# EAGLE design Mega-NTP-GPS-Shieldv3 (EAGLE 7.1.0)
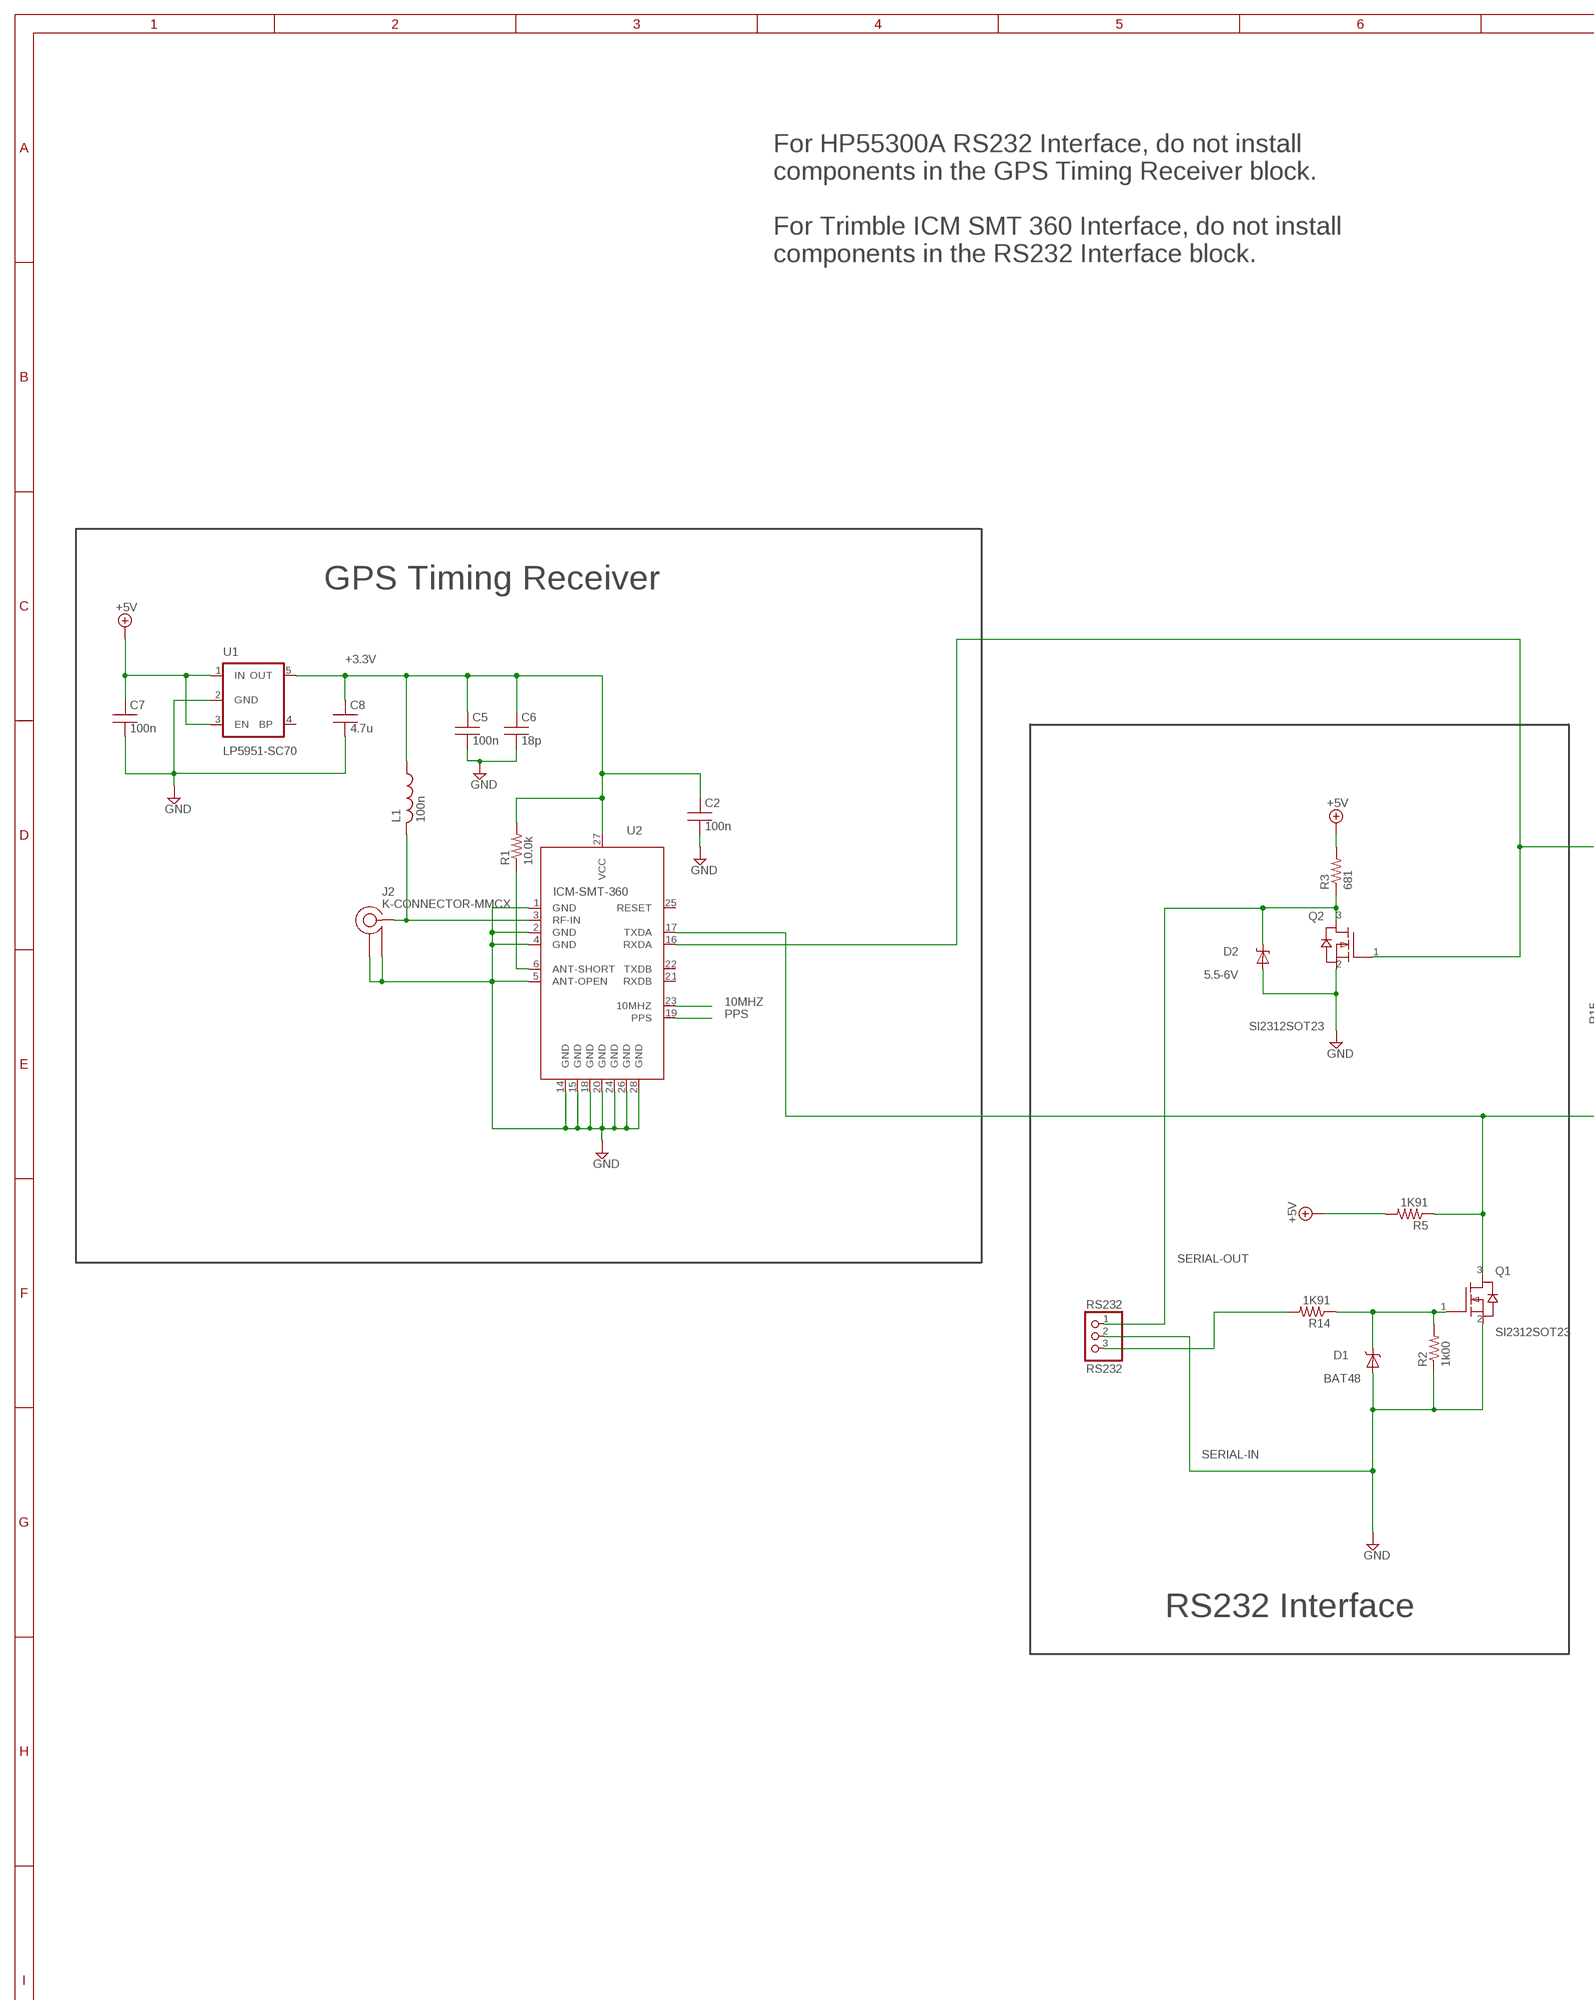
[diagram p0: schematic, sheet 1, part 1 of 2]
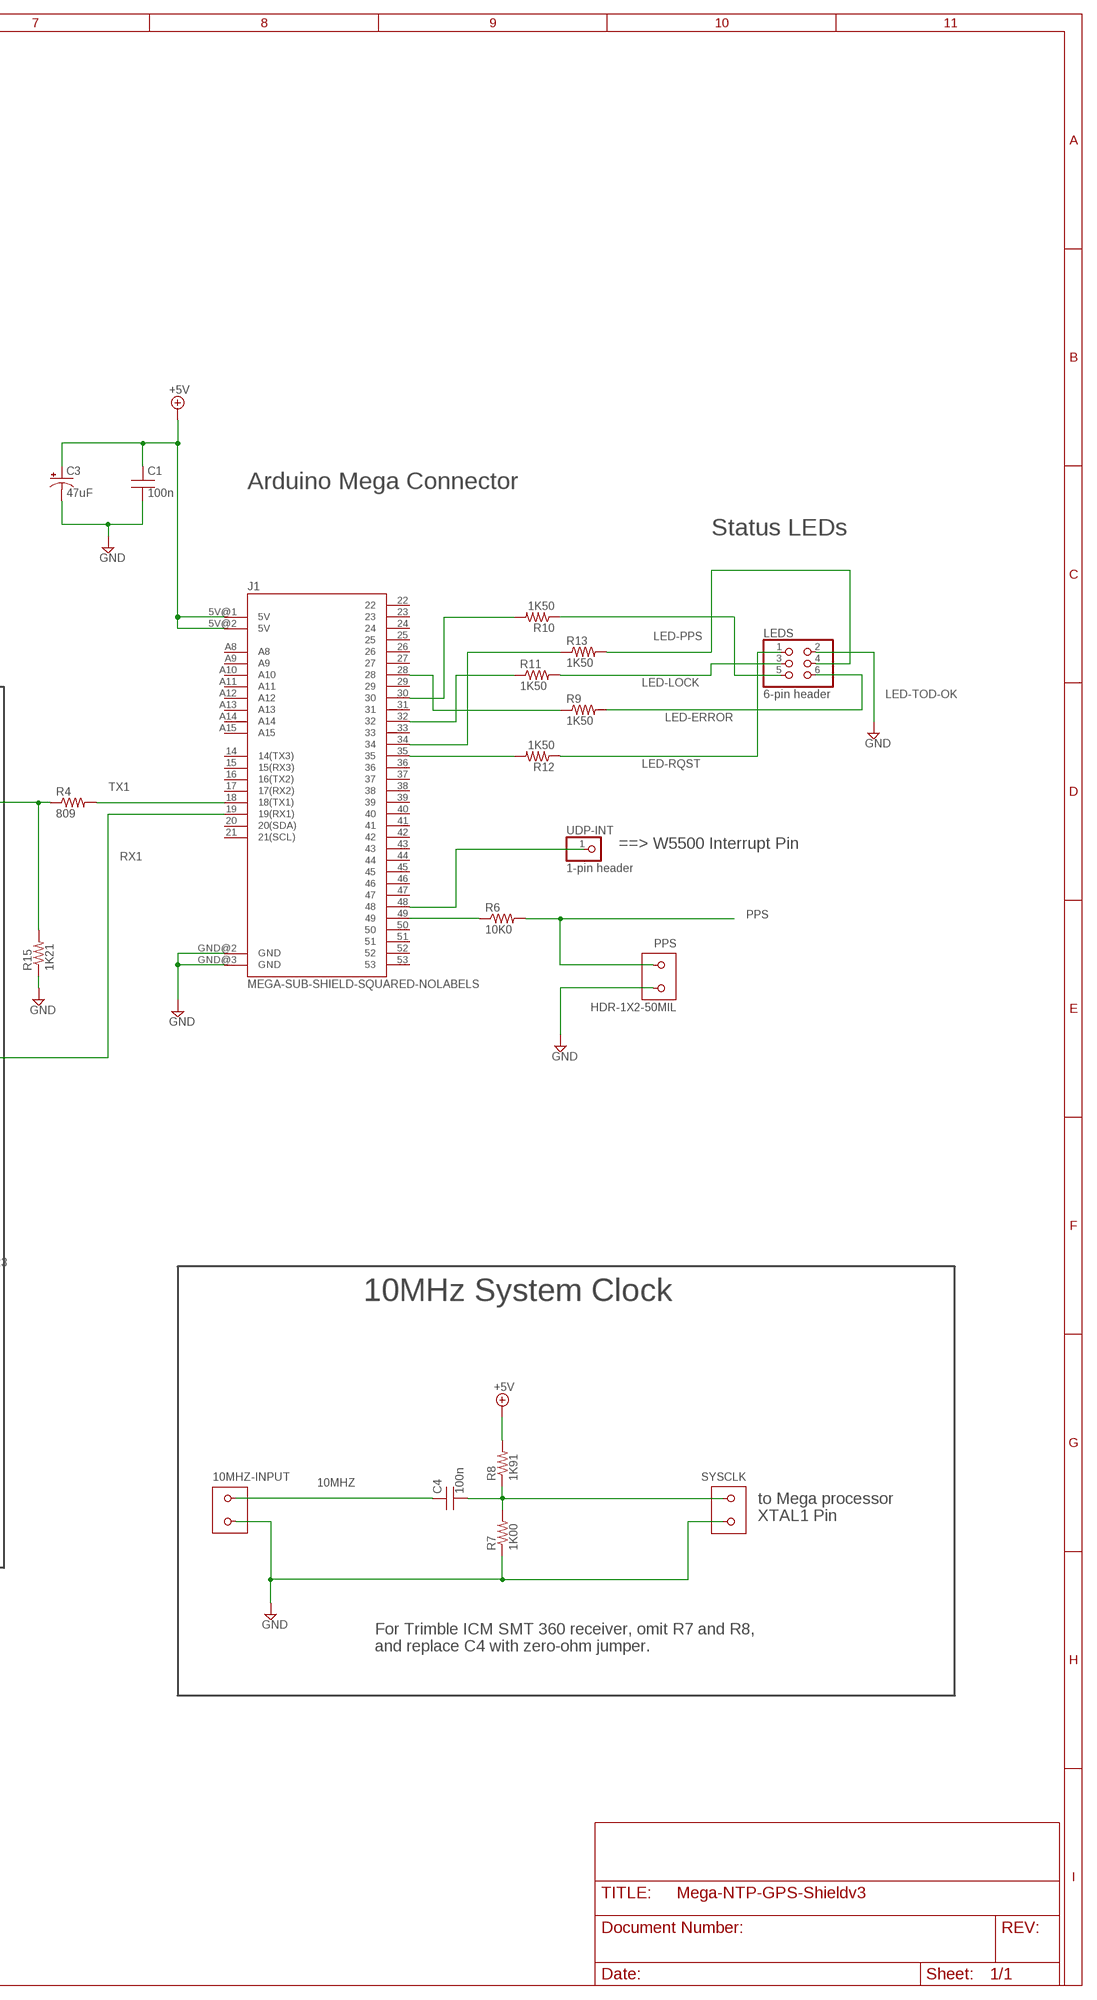
[diagram p1: schematic, sheet 1, part 2 of 2]

## Parts
10MHZ-INPUT  HDR-1X2-100MIL  [1X02-100MIL]
C1  100n  C-AVX-0805  [AVX-0805]
C2  100n  C-AVX-0805-NT  [AVX-0805-NT]
C3  47uF  47UF-TANT  [EIA3528]
C4  100n  C-AVX-0603  [AVX-0603]
C5  100n  C-AVX-0603-NT  [AVX-0603-NT]
C6  18p  C-AVX-0402-NT  [AVX-0402-NT]
C7  100n  C-AVX-0603-NT  [AVX-0603-NT]
C8  4.7u  C-AVX-0805-NT  [AVX-0805-NT]
D1  BAT48  DIODE-SCHOTTKY-SOD323  [SOD-323]
D2  5.5-6V  DIODE-ZENER-BZT52  [SOD-323]
J1  MEGA-SUB-SHIELD-SQUARED-NOLABELS  [MEGA-SUB-SHIELD-SQUARED-NOLABELS]
J2  K-CONNECTOR-MMCX  [MOLEX-MMCX-VERTICAL]
L1  100n  MURATA-LQW04A-LQW181-NT  [AVX-0603-NT]
LEDS  6-pin header  HDR-2X3-ROW-SWAP-50MIL  [2X03-50MIL]
PPS  HDR-1X2-50MIL  [1X02-50MIL]
Q1  SI2312SOT23  [SOT23]
Q2  SI2312SOT23  [SOT23]
R1  10.0k  R-AVX-0603  [AVX-0603]
R2  1k00  R-AVX-0603-NT  [AVX-0603-NT]
R3  681  R-AVX-0603  [AVX-0603]
R4  809  R-AVX-0603  [AVX-0603]
R5  1K91  R-AVX-0603  [AVX-0603]
R6  10K0  R-AVX-0603  [AVX-0603]
R7  1K00  R-AVX-0603  [AVX-0603]
R8  1K91  R-AVX-0603  [AVX-0603]
R9  1K50  R-AVX-0603  [AVX-0603]
R10  1K50  R-AVX-0603  [AVX-0603]
R11  1K50  R-AVX-0603  [AVX-0603]
R12  1K50  R-AVX-0603  [AVX-0603]
R13  1K50  R-AVX-0603  [AVX-0603]
R14  1K91  R-AVX-0603  [AVX-0603]
R15  1K21  R-AVX-0603-NT  [AVX-0603-NT]
RS232  RS232  HDR-1X3-ALL-SWAP-100-MIL  [1X03-100MIL]
SYSCLK  HDR-1X2-100MIL  [1X02-100MIL]
U1  LP5951-SC70  V_REG_LDOSMD2  [SC70]
U2  ICM-SMT-360  TRIMBLE-ICM-SMT-360-GPS-TIMING-MODULE  [TRIMBLE-ICM-SMT-360]
UDP-INT  1-pin header  PINHD-1X1  [1X01]

## Nets
10MHZ: 10MHZ-INPUT.1 C4.1 U2.23(10MHZ)
+3.3V: C2.1 C5.1 C6.1 C8.1 L1.1 R1.2 U1.5(OUT) U2.27(VCC)
+5V: C1.1 C3.A(+) C7.1 J1.5V@1(5V) J1.5V@2(5V) R3.2 R5.2 R8.2 U1.1(IN) U1.3(EN)
ANTENNA: J2.CENTER L1.2 U2.3(RF-IN)
GND: 10MHZ-INPUT.2 C1.2 C2.2 C3.C(-) C5.2 C6.2 C7.2 C8.2 D1.2(A) D2.2(A) J1.GND@2(GND) J1.GND@3(GND) J2.GND1 J2.GND2 LEDS.2 PPS.2 Q1.2(S) Q2.2(S) R2.1 R7.1 R15.1 RS232.2 SYSCLK.2 U1.2(GND) U2.1(GND) U2.2(GND) U2.4(GND) U2.5(ANT-OPEN) U2.14(GND) U2.15(GND) U2.18(GND) U2.20(GND) U2.24(GND) U2.26(GND) U2.28(GND)
LED-ERROR: LEDS.6 R9.2
LED-LOCK: LEDS.3 R11.2
LED-PPS: LEDS.4 R13.2
LED-RQST: LEDS.1 R12.1
LED-TOD-OK: LEDS.5 R10.1
N$1: Q2.1(G) R4.1 R15.2 U2.16(RXDA)
N$3: C4.2 R7.2 R8.1 SYSCLK.1
N$4: R1.1 U2.6(ANT-SHORT)
N$7: J1.49 R6.1
N$10: D1.1(C) Q1.1(G) R2.2 R14.1
N$11: J1.48 UDP-INT.1
N$17: J1.34 R13.1
N$18: J1.35 R12.2
N$19: J1.32 R11.1
N$20: J1.30 R10.2
N$21: J1.28 R9.1
PPS: PPS.1 R6.2 U2.19(PPS)
RX1: J1.19(19(RX1)) Q1.3(D) R5.1 U2.17(TXDA)
SERIAL-IN: R14.2 RS232.3
SERIAL-OUT: D2.1(C) Q2.3(D) R3.1 RS232.1
TX1: J1.18(18(TX1)) R4.2
Unconnected: J1.14(14(TX3)) J1.15(15(RX3)) J1.16(16(TX2)) J1.17(17(RX2)) J1.20(20(SDA)) J1.21(21(SCL)) J1.22 J1.23 J1.24 J1.25 J1.26 J1.27 J1.29 J1.31 J1.33 J1.36 J1.37 J1.38 J1.39 J1.40 J1.41 J1.42 J1.43 J1.44 J1.45 J1.46 J1.47 J1.50 J1.51 J1.52 J1.53 J1.A8 J1.A9 J1.A10 J1.A11 J1.A12 J1.A13 J1.A14 J1.A15 U1.4(BP) U2.21(RXDB) U2.22(TXDB) U2.25(RESET)

## Notes on the sheet
- For HP55300A RS232 Interface, do not install
  components in the GPS Timing Receiver block.
  
  For Trimble ICM SMT 360 Interface, do not install 
  components in the RS232 Interface block.
- Arduino Mega Connector
- Status LEDs
- GPS Timing Receiver
- ==> W5500 Interrupt Pin
- 10MHz System Clock
- to Mega processor
  XTAL1 Pin
- RS232 Interface
- For Trimble ICM SMT 360 receiver, omit R7 and R8,
  and replace C4 with zero-ohm jumper.

## Library data of the parts
10MHZ-INPUT PPS SYSCLK = max-local:HDR-1X2: Discrete wire thru-hole pattern (2-wires) 45-mil holes for 18-gauge wire on 150-mil centers
C1 C2 = max-local:C-AVX-0805: AVX 0805 SMT Capacitor Footprint as recommended by AVX in their SMT capacitor catalog. Should also work for Panasonic PPS film capacitors in size codes J1, J2.; MFR: AVX; MPN: 0805(3/5)C104(J/K)ATxx
C3 = SparkFun-Capacitors:47UF-TANT: 47uF Tantalum SMT CAP-08310- 10V 10% (EIA-3528); MFR: Vishay/Sprague; MPN: TR3B476K010C0350; PROD_ID: CAP-08310
C4 C5 C7 = max-local:C-AVX-0603: AVX 0603 SMT Capacitor Footprint as recommended by AVX in their SMT capacitor catalog. Should also work for Panasonic PPS film capacitors in size code K1.; MFR: AVX; MPN: 0603(3/5)C104(J/K)ATxx
C6 = max-local:C-AVX-0402; MFR: AVX; MPN: 04025A180JATxx
C8 = max-local:C-AVX-0805: AVX 0805 SMT Capacitor Footprint as recommended by AVX in their SMT capacitor catalog. Should also work for Panasonic PPS film capacitors in size codes J1, J2.; MFR: AVX; MPN: C0805YC475KATxx
D1 = SparkFun-DiscreteSemi:DIODE-SCHOTTKY: Commonly MBRA140.
D2 = SparkFun-DiscreteSemi:DIODE-ZENER: Zener Diode Production Part - 8199 3.4V Zener Voltage
J1 = SparkFun-Boards:MEGA-SUB-SHIELD: Shield for Mega that only uses lower pins Will not interfere with shields like the Ethernet which need to plug into the ICSP pins.
J2 = max-local:K-CONNECTOR: K-Connector; DIGIKEY: WM3914CT-ND; MFR: Molex; MPN: 73415-206x
L1 = max-local:MURATA-LQW04A: Murata high-frequency wirewound SMT inductors LQW04A is the 0315 package, and LQW15A is the 0402 size; MFR: Murata; MPN: LQW18ANR10J00
LEDS = max-local:HDR-2X3-ROW-SWAP
Q1 Q2 = max-local:SI2312: Siliconix Si2313 N-channel MOSFET 20V, 6A, 0.026 ohm (4.5V Vgs); MFR: Siliconix; MPN: SI2312BDS
R1 = max-local:R-AVX-0603: SMT 0603 Resistor Footprint from AVX SMT capacitor catalog.; MFR: Vishay/Dale; MPN: CRCW060310.0kFKxx
R2 R14 R15 = max-local:R-AVX-0603: SMT 0603 Resistor Footprint from AVX SMT capacitor catalog.; MFR: Vishay/Dale; MPN: CRCW06034K02FKxx
R3 = max-local:R-AVX-0603: SMT 0603 Resistor Footprint from AVX SMT capacitor catalog.; MFR: Vishay/Dale; MPN: CRCW0603DNP (681)FKxx
R4 R5 R7 R8 = max-local:R-AVX-0603: SMT 0603 Resistor Footprint from AVX SMT capacitor catalog.; MFR: Vishay/Dale; MPN: CRCW06031K91FKxx
R6 = max-local:R-AVX-0603: SMT 0603 Resistor Footprint from AVX SMT capacitor catalog.; MFR: Vishay/Dale; MPN: CRCW060310K0FKxx
R9-R13 = max-local:R-AVX-0603: SMT 0603 Resistor Footprint from AVX SMT capacitor catalog.; MFR: Vishay/Dale; MPN: CRCW06031K50FKxx
RS232 = max-local:HDR-1X3-ALL-SWAP
U1 = SparkFun-PowerIC:V_REG_LDO: Voltage Regulator LDO Standard 150mA LDO voltage regulator in SOT-23 layout. Micrel part MIC5205. BP (by-pass) pin is used to lower output noise with 470pF cap.; MFR: TI; MPN: LP5951MG-3.3/NOPB
U2 = max-local:TRIMBLE-ICM-SMT-360-GPS-TIMING-MODULE: Trimble GPS Timing Module ICM 360 SMT; MFR: Trimble; MPN: ICM-SMT-360
UDP-INT = pinhead:PINHD-1X1: PIN HEADER

## Board
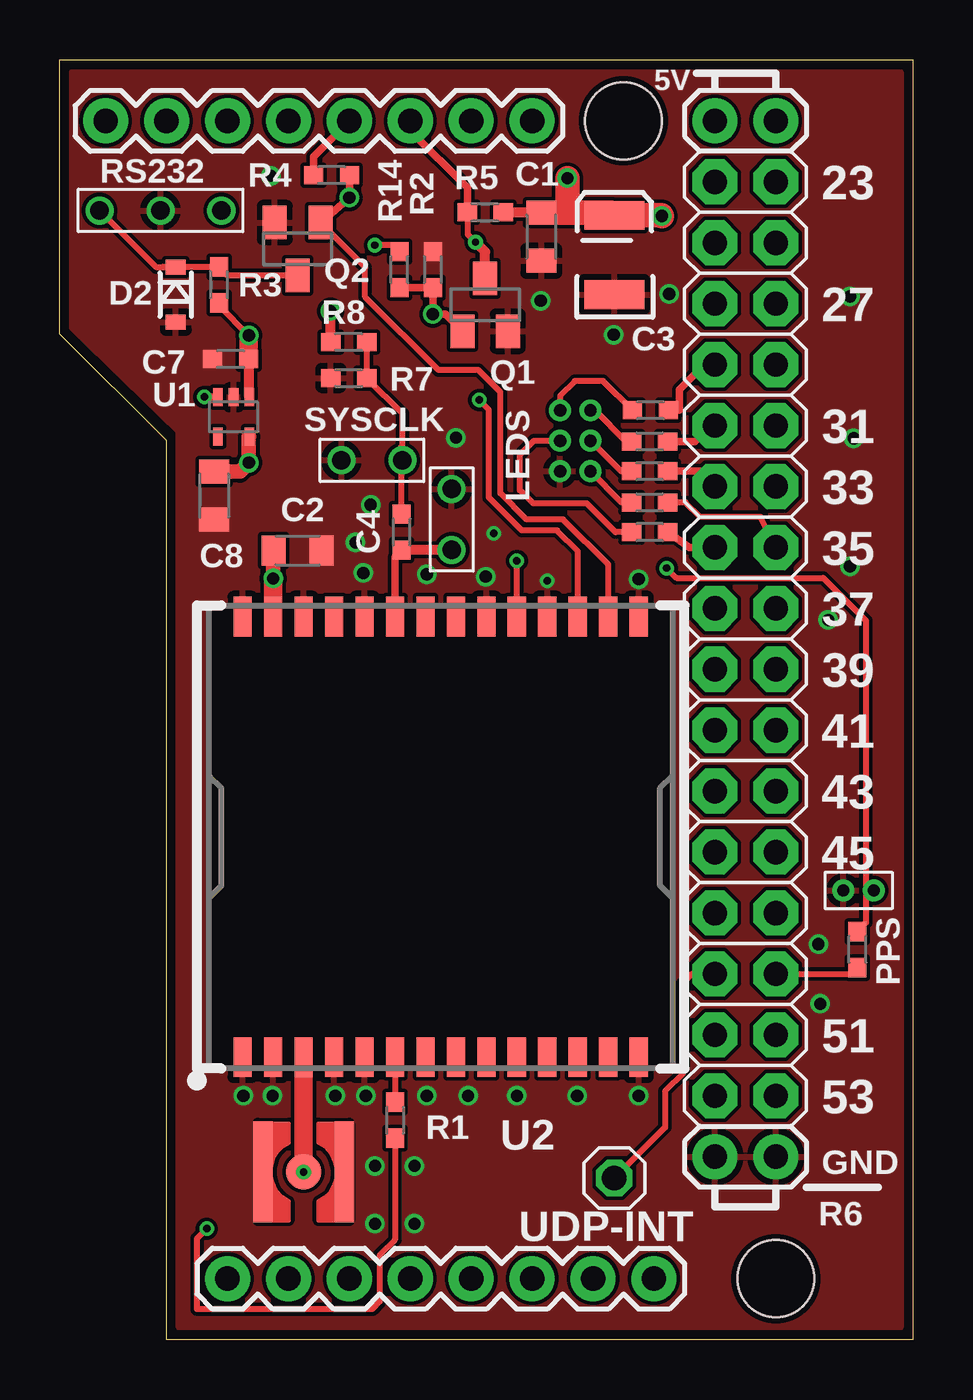
[diagram p2: board, top side]
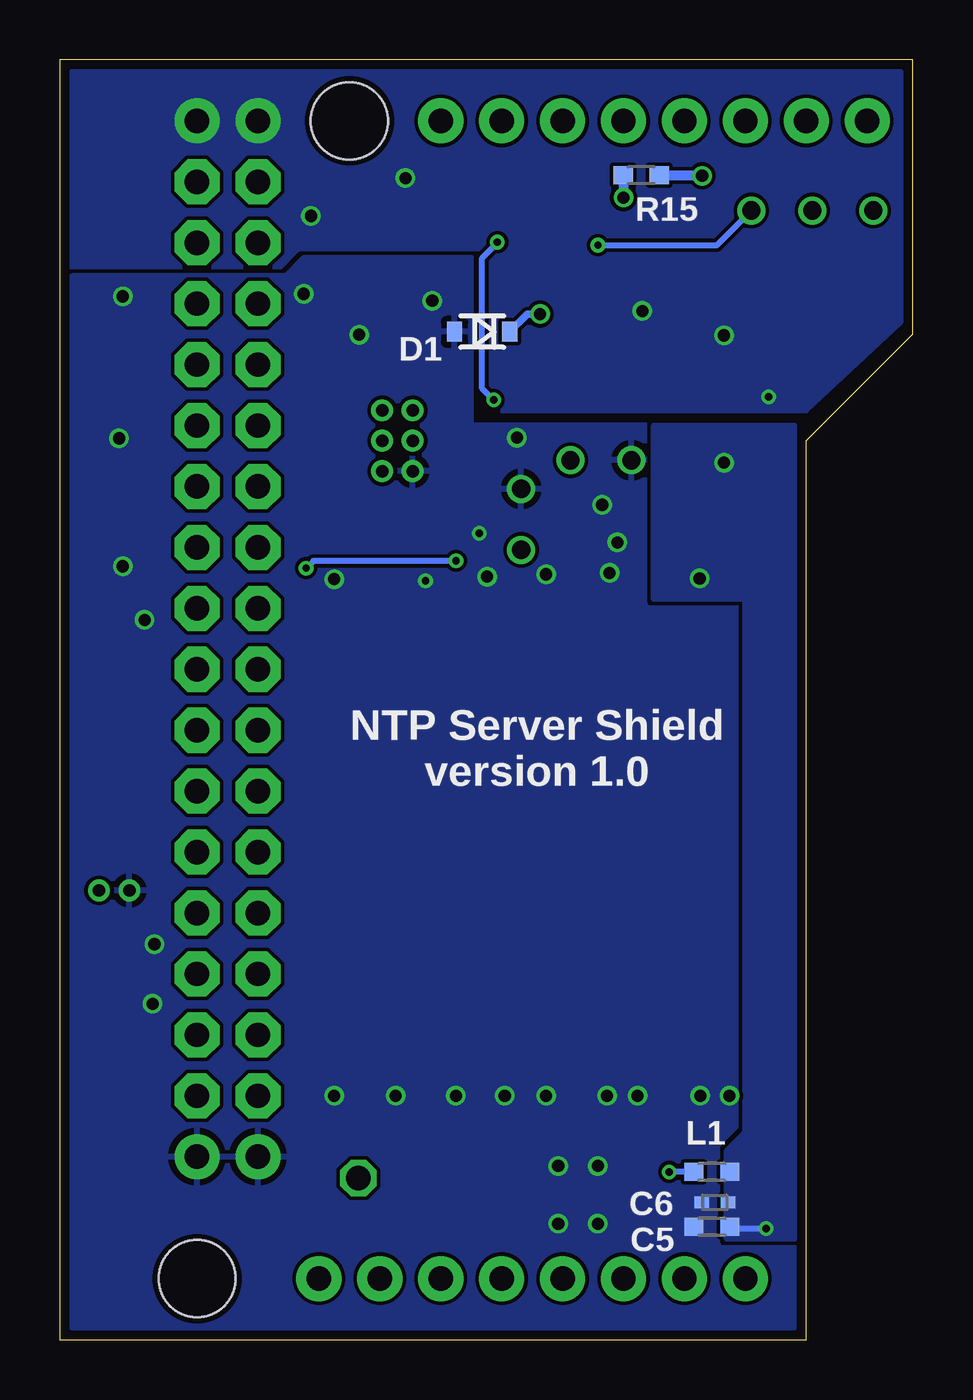
[diagram p3: board, bottom side, seen from below]

Size 35.56 x 53.34 mm. Coordinates in mm from the lower left corner, seen from the top.
Copper layers (1*16): Top 0.035mm / dielectric 1.5mm / Bottom 0.035mm
Design rules "SeeedStudio_2layer_DRU_no_angle_20140221 *": minimum track width 6mil, minimum drill 12mil, track to track 6mil, track to pad 6mil, pad to pad 6mil, via to via 6mil, smd to smd 0mil, copper to edge 10mil, drill to drill 10mil, minimum pad ring 8mil, minimum via ring 6mil, stop-mask expansion 2mil, vias tented up to drill 100mil, thermal gap 10mil

### Footprints (pad centres in the part's own frame; a part is rotated, then mirrored left to right if it is on the bottom)
1X02-100MIL = drill 0.762: 1 -1.27,0; 2 1.27,0
AVX-0805 = smd 1 x 1.25: 1 -1,0; 2 1,0
AVX-0805-NT = smd 1 x 1.25: 1 -1,0; 2 1,0
EIA3528 = smd 1.2 x 2.5: A 1.65,0; C -1.65,0
AVX-0603 = smd 0.8 x 0.75: 1 -0.75,0; 2 0.75,0
AVX-0603-NT = smd 0.8 x 0.75: 1 -0.75,0; 2 0.75,0
AVX-0402-NT = smd 0.6 x 0.5: 1 -0.55,0; 2 0.55,0
SOD-323 = smd 0.63 x 0.83: 1 -1.15,0; 2 1.15,0
MEGA-SUB-SHIELD-SQUARED-NOLABELS = drill 1.016 pad 1.88: 5V@1 27.305,50.8; 5V@2 29.845,50.8; 14 1.905,50.8; 15 4.445,50.8; 16 6.985,50.8; 17 9.525,50.8; 18 12.065,50.8; 19 14.605,50.8; 20 17.145,50.8; 21 19.685,50.8; A8 6.985,2.54; A9 9.525,2.54; A10 12.065,2.54; A11 14.605,2.54; A12 17.145,2.54; A13 19.685,2.54; A14 22.225,2.54; A15 24.765,2.54; GND@2 27.305,7.62; GND@3 29.845,7.62 | drill 1.016 pad 1.88 octagon: 22 27.305,48.26; 23 29.845,48.26; 24 27.305,45.72; 25 29.845,45.72; 26 27.305,43.18; 27 29.845,43.18; 28 27.305,40.64; 29 29.845,40.64; 30 27.305,38.1; 31 29.845,38.1; 32 27.305,35.56; 33 29.845,35.56; 34 27.305,33.02; 35 29.845,33.02; 36 27.305,30.48; 37 29.845,30.48; 38 27.305,27.94; 39 29.845,27.94; 40 27.305,25.4; 41 29.845,25.4; 42 27.305,22.86; 43 29.845,22.86; 44 27.305,20.32; 45 29.845,20.32; 46 27.305,17.78; 47 29.845,17.78; 48 27.305,15.24; 49 29.845,15.24; 50 27.305,12.7; 51 29.845,12.7; 52 27.305,10.16; 53 29.845,10.16 | hole 3.2: 23.495,50.8; 29.845,2.54
MOLEX-MMCX-VERTICAL = smd 1.473 x 1.473: CENTER 0,0 | smd 0.813 x 4.216: GND1 -1.702,0; GND2 1.702,0
2X03-50MIL = drill 0.508 pad 0.914: 1 -1.27,-0.635; 2 -1.27,0.635; 3 0,-0.635; 4 0,0.635; 5 1.27,-0.635; 6 1.27,0.635
1X02-50MIL = drill 0.508: 1 -0.635,0; 2 0.635,0
SOT23 = smd 1 x 1.4: 1 -0.95,-1.1; 2 0.95,-1.1; 3 0,1.1
1X03-100MIL = drill 0.762: 1 -2.54,0; 2 0,0; 3 2.54,0
SC70 = smd 0.4 x 0.75: 1 -0.65,-0.825; 2 0,-0.825; 3 0.65,-0.825; 4 0.65,0.825; 5 -0.65,0.825
TRIMBLE-ICM-SMT-360 = smd 1.651 x 0.762: 1 -9.182,8.255; 2 -9.182,6.985; 3 -9.182,5.715; 4 -9.182,4.445; 5 -9.182,3.175; 6 -9.182,1.905; 7 -9.182,0.635; 8 -9.182,-0.635; 9 -9.182,-1.905; 10 -9.182,-3.175; 11 -9.182,-4.445; 12 -9.182,-5.715; 13 -9.182,-6.985; 14 -9.182,-8.255; 15 9.182,-8.255; 16 9.182,-6.985; 17 9.182,-5.715; 18 9.182,-4.445; 19 9.182,-3.175; 20 9.182,-1.905; 21 9.182,-0.635; 22 9.182,0.635; 23 9.182,1.905; 24 9.182,3.175; 25 9.182,4.445; 26 9.182,5.715; 27 9.182,6.985; 28 9.182,8.255
1X01 = drill 1.016 octagon: 1 0,0

### Placement (x,y rotation side)
10MHZ-INPUT  16.33,34.19 90 top
C1  20.07,45.97 270 top
C2  9.91,32.89 0 top
C3  23.11,45.21 90 top
C4  14.25,33.66 90 top
C5  8.38,4.7 180 bottom
C6  8.26,5.71 180 bottom
C7  7.11,40.87 180 top
C8  6.43,35.18 270 top
D1  17.96,42.01 180 bottom
D2  4.83,43.56 270 top
J1  0,0 0 top
J2  10.16,6.99 0 top
L1  8.38,6.99 180 bottom
LEDS  21.49,37.47 90 top
PPS  33.3,18.72 180 top
Q1  17.73,43.13 0 top
Q2  9.91,45.47 180 top
R1  13.97,9.14 270 top
R2  15.54,44.6 270 top
R3  6.63,43.97 270 top
R4  11.33,48.54 180 top
R5  17.73,46.99 0 top
R6  33.25,16.26 90 top
R7  12.04,40.08 0 top
R8  12.04,41.58 180 top
R9  24.61,38.73 180 top
R10  24.59,37.44 0 top
R11  24.59,36.2 180 top
R12  24.59,34.9 0 top
R13  24.59,33.66 180 top
R14  14.15,44.6 90 top
R15  11.33,48.54 180 bottom
RS232  4.19,47.07 0 top
SYSCLK  13,36.65 180 top
U1  7.24,38.46 180 top
U2  15.88,20.95 90 top
UDP-INT  23.11,6.73 0 top

### Tracks (layer width: path | path; a pad name or v marks a point on that pad's centre or on a via)
10MHZ
  Top 0.305: U2.23 13.97,32.63 C4.1
  Top 0.406: 10MHZ-INPUT.1 C4.1
+3.3V  (via drill 0.3, 0.51)
  Top 0.254: R1.2 13.97,4.17 13.34,3.53 13.34,1.57 13.03,1.27 5.71,1.27 5.71,4.22 v6.12,4.62
  Top 0.61: U1.5 7.87,37.63 v7.87,36.55 7.5,36.18 C8.1 | v8.89,31.73 8.89,33.16 C2.1
  Top 0.762: U2.27 v8.89,31.73
  Bottom 0.254: v6.12,4.62 7.56,4.62 C5.1
  pour Bottom: 4.95,38.1 4.95,30.86 10.79,30.86 10.79,38.1
  pour Bottom: 4.95,30.99 4.95,4.19 7.75,4.19 7.75,7.87 6.99,8.64 6.99,30.99
+5V  (via drill 0.3, 0.51)
  Top 0.254: v7.87,41.86 6.63,43.1 R3.2
  Top 0.305: U1.3 5.91,39.28 v6.02,39.29
  Top 0.406: R5.2 20.05,46.99 C1.1 | U1.1 7.89,40.84 C7.1 | R8.2 11.29,42.86 v11.28,42.88
  Top 0.762: C7.1 7.86,41.85 v7.87,41.86
  Top 1.016: v25.09,46.84 25.07,46.86 C3.A 23,46.97 C1.1 | v21.16,48.41 21.16,46.99
  pour Bottom (rank 2, no thermals): 4.45,38.73 0.51,42.42 0.51,52.83 35.05,52.83 35.05,38.73
ANTENNA  (via drill 0.3)
  Top 0.762: U2.3 J2.CENTER
  Bottom 0.254: L1.2 J2.CENTER
  other vias: 10.16,6.99
GND  (via drill 0.3, 0.51)
  Bottom 0.406: R15.1 8.79,48.54 v8.79,48.51
  other vias: 12.32,33.22 17.75,31.8 18.08,33.6 20.32,31.62 24.13,10.16 31.62,16.48 31.7,14 32.03,30 32.94,32.23 17.02,10.16 15.29,10.16 19.05,10.16 21.56,10.16 11.48,10.16 8.86,10.16 7.65,10.16 33.1,37.57 15.29,31.9 16.51,37.59 12.95,34.8 32.94,43.48 25.4,43.59 20.04,43.31 12.65,31.95 13.13,7.24 13.13,4.83 14.78,4.83 14.78,7.24 12.75,10.16 23.09,41.88 24.13,31.7
  pour Top: 4.95,0.51 4.95,37.85 0.51,42.16 0.51,52.83 35.05,52.83 35.05,0.51
  pour Bottom (rank 2): 4.95,38.1 35.05,38.1 35.05,0.51 4.95,0.51
  pour Bottom: 18.41,36.2 18.41,45.09 25.4,45.09 26.14,44.32 35.05,44.32 35.05,36.2
LED-ERROR
  Top 0.254: R9.2 22.64,39.95 21.46,39.95 20.85,39.34 LEDS.6
LED-LOCK
  Top 0.254: R11.2 23.39,36.2 LEDS.3
LED-PPS
  Top 0.254: R13.2 23.16,33.66 21.97,34.85 19.74,34.85 19.18,35.41 19.18,36.88 19.76,37.47 LEDS.4
LED-RQST
  Top 0.254: R12.1 23.42,34.9 LEDS.1
LED-TOD-OK
  Top 0.254: R10.1 23.6,37.44 22.3,38.73
  Top 0.305: 22.3,38.73 LEDS.5
N$1  (via drill 0.51)
  Top 0.254: U2.16 22.86,32.31 20.98,34.19 19.46,34.19 18.36,35.28 18.36,39.5 17.45,40.41 15.77,40.41 12.72,43.46 12.72,44.7 Q2.1
  Top 0.305: R15.2 12.06,48.54 v12.06,47.6 Q2.1
  Bottom 0.406: R15.2 12.06,48.54 v12.06,47.6
N$3
  Top 0.254: R8.1 R7.2 14.28,38.6 SYSCLK.1 14.25,37.26 C4.2
N$4
  Top 0.254: U2.6 R1.1
N$7
  Top 0.254: J1.49 33.03,15.24 R6.1
N$10  (via drill 0.51)
  Top 0.305: R14.1 R2.2 v15.54,42.75 16.07,42.75 Q1.1
  Bottom 0.305: v15.54,42.75 16.07,42.75 D1.1
N$11
  Top 0.254: J1.48 26.34,15.24 25.98,14.88 25.98,11.12 25.22,10.36 25.22,8.84 UDP-INT.1
N$17
  Top 0.305: J1.34 26.25,33.02 R13.1
N$18
  Top 0.254: J1.35 29.21,34.29 26.7,34.29 26.09,34.9 R12.2
N$19
  Top 0.305: J1.32 26.67,36.2 R11.1
N$20
  Top 0.305: J1.30 26.47,37.44 R10.2
N$21
  Top 0.305: J1.28 26.87,40.64 25.83,39.6 25.83,38.75 R9.1
PPS  (via drill 0.3)
  Top 0.254: 33.6,18.75 33.6,29.97 31.83,31.75 25.7,31.75 v25.3,32.16 | 33.6,18.75 33.6,17.38 R6.2 | PPS.1 33.63,18.72 33.6,18.75 | U2.19 v19.05,32.46
  Bottom 0.254: v19.05,32.46 24.99,32.46 v25.3,32.16
RX1  (via drill 0.3)
  Top 0.254: U2.17 21.59,32.87 20.73,33.73 19.25,33.73 17.88,35.1 17.88,38.76 v17.48,39.17 | 16.99,47 16.99,46.91 16.99,46.08 v17.32,45.74
  Top 0.305: J1.19 14.61,50.39 16.99,48.01 16.99,47
  Top 0.406: v17.32,45.74 17.73,45.34 Q1.3 | R5.1 16.99,46.99 16.99,46.91
  Bottom 0.254: v17.48,39.17 17.96,39.65 17.96,45.09 17.32,45.72 v17.32,45.74
SERIAL-IN  (via drill 0.3)
  Top 0.254: R14.2 13.88,45.62 v13.13,45.62
  Bottom 0.254: v13.13,45.62 8.18,45.62 RS232.3
SERIAL-OUT
  Top 0.254: RS232.1 4.01,44.71 D2.1 4.27,44.72 R3.1 6.98,44.37 Q2.3
TX1
  Top 0.305: R4.2 10.58,49.31 J1.18

### Text on the board
bPlace: NTP Server Shield / version 1.0